# EasyEDA Pro project ProProject_Quantum Mega_v0.2_2024-08-26.epro, schematic Top
Create Date: 2024-05-17; Page Name: P1; Project Name: Quantum Mega; Schematic Name: Top; Update Date: 2024-08-18; Company: EasyEDA.com; Drawn: EasyEDA; Page Size: A4; Part Number: JLCPCB-002; Reviewed: EasyEDA; Version: V0.1
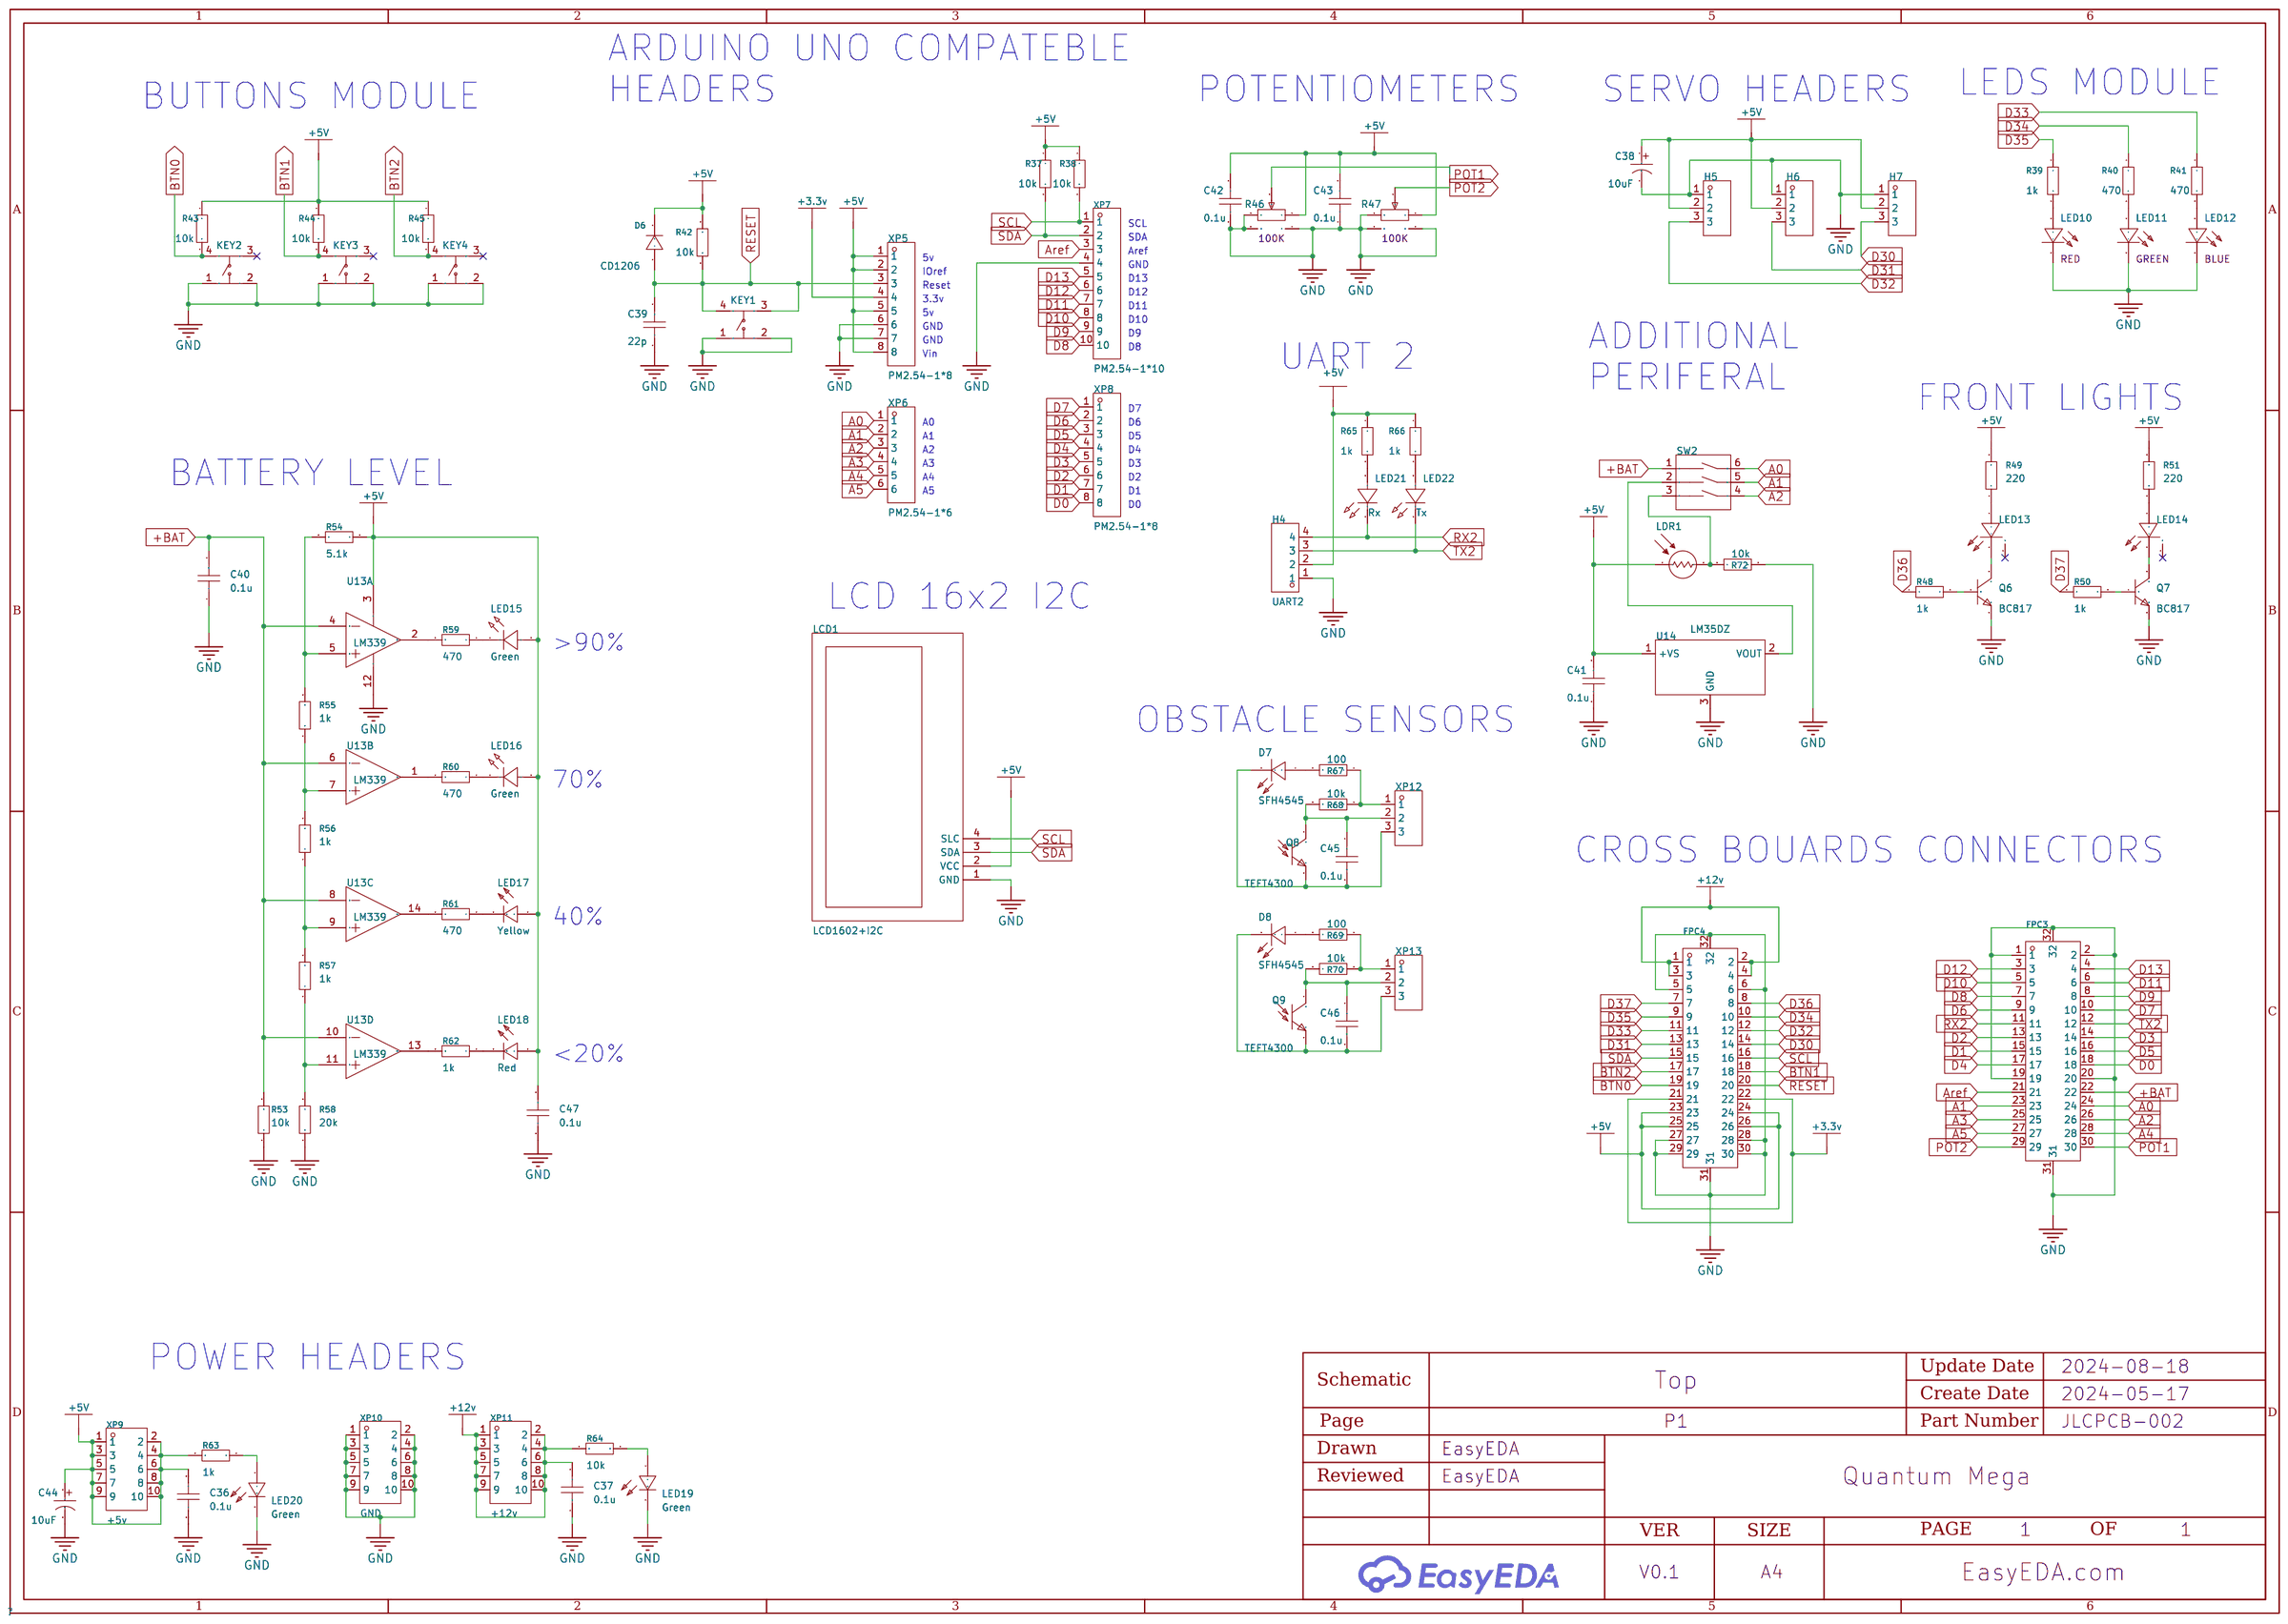
[diagram p1: schematic sheet]

## Parts
C36  0.1u  [C0805]
C37  0.1u  [C0805]
C38  10uF  [CAP-SMD_L3.5-W2.8-R-RD]
C39  22p  [C0805]
C40  0.1u  [C0805]
C41  0.1u  [C0805]
C42  0.1u  [C0805]
C43  0.1u  [C0805]
C44  10uF  [CAP-SMD_L3.5-W2.8-R-RD]
C45  0.1u  [C0805]
C46  0.1u  [C0805]
C47  0.1u  [C0805]
D6  CD1206  [D1206-RD]
D7  SFH4545  [LED-TH_BD5.0-P2.54-FD]
D8  SFH4545  [LED-TH_BD5.0-P2.54-FD]
FPC3  FFC05012-30SSA124W5M  [FPC-SMD_FFC05012-30SSA124W5M]
FPC4  FFC05012-30SSA124W5M  [FPC-SMD_FFC05012-30SSA124W5M]
H4  UART2  [HDR-TH_4P-P2.54-H-M-W10.3]
H5  D32  [HDR-TH_3P-P2.54-V-M]
H6  D31  [HDR-TH_3P-P2.54-V-M]
H7  D30  [HDR-TH_3P-P2.54-V-M]
KEY1  RESET  [KEY-TH_4P-L6.0-W6.0-P4.50-LS7.5]
KEY2  D41  [KEY-TH_4P-L6.0-W6.0-P4.50-LS7.5]
KEY3  D40  [KEY-TH_4P-L6.0-W6.0-P4.50-LS7.5]
KEY4  D39  [KEY-TH_4P-L6.0-W6.0-P4.50-LS7.5]
LCD1  LCD1602+I2C  [HDR-TH_4P-P2.54-V-F]
LDR1  -  [PHOTO_RESISTOR]
LED10  D35  [LED-TH_BD4.0-P2.54-FD_RED]
LED11  D34  [LED-TH_BD4.0-P2.54-FD_RED]
LED12  D33  [LED-TH_BD4.0-P2.54-FD_RED]
LED13  LED-1204-WHITE  [LED-SMD_3P-L3.20-W1.50-WHITE-SIDE-R-RD]
LED14  LED-1204-WHITE  [LED-SMD_3P-L3.20-W1.50-WHITE-SIDE-R-RD]
LED15  Green  [LED0805-RD_RED]
LED16  Green  [LED0805-RD_YELLOW]
LED17  Yellow  [LED0805-R-RD_GREEN]
LED18  Red  [LED0805-R-RD_GREEN]
LED19  12v  [LED0805-R-RD_GREEN]
LED20  5v  [LED0805-R-RD_GREEN]
LED21  Rx  [LED0805-RD_RED]
LED22  Tx  [LED0805-RD_RED]
Q6  BC817  [SOT-23(SOT-23-3)]
Q7  BC817  [SOT-23(SOT-23-3)]
Q8  TEFT4300  [SENSOR-TH_TEFT4300]
Q9  TEFT4300  [SENSOR-TH_TEFT4300]
R37  10k  [R0805]
R38  10k  [R0805]
R39  1k  [R0805]
R40  470  [R0805]
R41  470  [R0805]
R42  10k  [R0805]
R43  10k  [R0805]
R44  10k  [R0805]
R45  10k  [R0805]
R46  A6  [RES-TH_RK09K1130AAU]
R47  A7  [RES-TH_RK09K1130AAU]
R48  1k  [R0805]
R49  220  [R0805]
R50  1k  [R0805]
R51  220  [R0805]
R53  10k  [R0805]
R54  5.1k  [R0805]
R55  1k  [R0805]
R56  1k  [R0805]
R57  1k  [R0805]
R58  20k  [R0805]
R59  470  [R0805]
R60  470  [R0805]
R61  470  [R0805]
R62  1k  [R0805]
R63  1k  [R0805]
R64  10k  [R0805]
R65  1k  [R0805]
R66  1k  [R0805]
R67  100  [R0805]
R68  10k  [R0805]
R69  100  [R0805]
R70  10k  [R0805]
R72  10k  [R0805]
SW2  KF1001-03P-B0-GL-DFT-01B  [SW-TH_6P-L9.9-W9.0-P2.54-LS7.6_BLUE]
U13  LM339  [SOP-14_L8.7-W3.9-P1.27-LS6.0-BL]  (sections 1,2,3,4)
U14  A1  [TO-92-3_L4.9-W3.7-P1.27-L]
XP5  PM2.54-1*8  [HDR-TH_8P-P2.54-V-F]
XP6  PM2.54-1*6  [HDR-TH_6P-P2.54-V-F]
XP7  PM2.54-1*10  [HDR-TH_10P-P2.54-V-F]
XP8  PM2.54-1*8  [HDR-TH_8P-P2.54-V-F]
XP9  +5v  [HDR-TH_10P-P2.54-V-F-R2-C5-S2.54-4]
XP10  GND  [HDR-TH_10P-P2.54-V-F-R2-C5-S2.54-4]
XP11  +12v  [HDR-TH_10P-P2.54-V-F-R2-C5-S2.54-4]
XP12  D32  [HDR-TH_3P-P2.54-V-M]
XP13  D32  [HDR-TH_3P-P2.54-V-M]

## Library data of the parts
C36 C37 C39-C43 C45-C47 = CAP_0805: Supplier Footprint: 0805
C38 C44 = CA45-B-25V-10uF-M: Capacitance: Tolerance:±20% Tolerance:±20% Rated Voltage: Equivalent Series Resistance(ESR):6Ω@100kHz Operating Temperature:-55℃~+125℃ Operating Temperature:-55℃~+125℃; LCSC Part Name: 10uF ±20% 25V; Supplier Part: C140404; Manufacturer: CEC(振华新云); Supplier Footprint: CASE-B-3528; JLCPCB Part Class: Extended Part; Datasheet: https://atta.szlcsc.com/upload/public/pdf/source/20171113/C140404_15105612875661115757.pdf; Supplier: LCSC; Tolerance: ±20%; Equivalent Series Resistance(ESR): 6Ω@100kHz; Operating Temperature: -55℃~+125℃
D6 = CD1206-S01575: Diode Configuration: Forward Voltage (Vf@If):1V@50mA Reverse Voltage (Vr): Average Rectified Current (Io): Power Dissipation: Reverse Leakage Current:2.5uA@75V Reverse Recovery Time (trr): Operating Temperature:-55℃~+125℃@(Tj) Operating Temperature:-55℃~+; LCSC Part Name: 电压:75V 电流:150mA 停产; Supplier Part: C75465; Manufacturer: BOURNS; Supplier Footprint: 1206; JLCPCB Part Class: Extended Part; Datasheet: https://atta.szlcsc.com/upload/public/pdf/source/20180126/C75465_15169562546211309449.pdf; Supplier: LCSC; Forward Voltage (Vf@If): 1V@50mA; Reverse Leakage Current: 2.5uA@75V; Operating Temperature: -55℃~+125℃@(Tj)
D7 D8 = SFH4550: Supplier Part: C706747; Supplier: LCSC
FPC3 FPC4 = FFC05012-30SSA124W5M: Locking Feature:抽屉式 Contact Type:单侧触点/Vertical Number of Contacts:30P Pitch:0.5mm Mounting Type:Brick nogging FFC, FCB Thickness:0.3mm FFC, FCB Thickness:0.3mm Height Above Board:- Operating Temperature Range:-40℃~+85℃ Operating Temperature Range:-40℃~+85; LCSC Part Name: 间距:0.5mm P数:30P 抽屉式 单侧触点/垂直; Supplier Part: C2834153; Manufacturer: TXGA(特思嘉); Supplier Footprint: SMD,P=0.5mm(交错脚); JLCPCB Part Class: Extended Part; Datasheet: https://atta.szlcsc.com/upload/public/pdf/source/20210517/C2834153_A4D413E3C8B5AC462050F50D944F5EA0.pdf; Supplier: LCSC; Locking Feature: 抽屉式; Contact Type: 单侧触点/Vertical; Number of Contacts: 30P; Pitch: 0.5mm; Mounting Type: Brick nogging; FFC, FCB Thickness: 0.3mm; Operating Temperature Range: -40℃~+85℃
H4 = 0022285044: Supplier Part: C9900016049; Supplier Footprint: TH-4P; JLCPCB Part Class: Extended Part; Supplier: LCSC
H5-H7 XP12 XP13 = 5-146277-3: Pitch:2.54mm Circluar Pins/Square Pins:Square Pins Mounting Type:Straight Number of Rows:Plugin Number of Pins:3P Current Rating (Max):3A Voltage Rating (Max):- Length of Mating Pin:8.08mm Insulation Height:2.29mm Length of End Connection Pin:3.18mm Conta; LCSC Part Name: 间距:2.54mm 直插 方针; Supplier Part: C3327863; Manufacturer: TE Connectivity(泰科电子); Supplier Footprint: 插件,P=2.54mm; JLCPCB Part Class: Extended Part; Datasheet: https://atta.szlcsc.com/upload/public/pdf/source/20240320/B5A87472A4F0F2898233D24AD0789840.pdf; Supplier: LCSC; Pitch: 2.54mm; Circluar Pins/Square Pins: Square Pins; Mounting Type: Straight; Number of Rows: Plugin; Number of Pins: 3P; Current Rating (Max): 3A; Length of Mating Pin: 8.08mm; Insulation Height: 2.29mm; Length of End Connection Pin: 3.18mm; Contact Plating: Tin; Operating Temperature Range: -65℃~+105℃; Color: Black
KEY1-KEY4 = TL1105F160Q: Circuit:SPST Actuator Style:Round Button Operating Force:160gf Mounting Style:Straight Switch Length:6mm Switch Width:6mm Switch Height:0.7mm Contact Current:50mA Voltage Rating (DC):12V With Lamp:- Pin Style:PCPin Mechanical Life:- Operating Temperature:; LCSC Part Name: 6*6*0.7mm 直插 轻触开关; Supplier Part: C273473; Manufacturer: E-Switch; Supplier Footprint: 插件,6x6mm; JLCPCB Part Class: Extended Part; Datasheet: https://atta.szlcsc.com/upload/public/pdf/source/20180927/C273473_CCBD97E41A3934EE0DE01B218410C479.pdf; Supplier: LCSC; Circuit: SPST; Actuator Style: Round Button; Operating Force: 160gf; Mounting Style: Straight; Switch Length: 6mm; Switch Width: 6mm; Switch Height: 0.7mm; Contact Current: 50mA; Voltage Rating (DC): 12V; Pin Style: PCPin; Operating Temperature: -20℃~+70℃
LCD1 = LCD1602+I2C
LDR1 = Photo-Resistor
LED10 = LED: Supplier Part: C9900015665; Manufacturer Part: RED; Supplier Footprint: SIP-2P; Supplier: LCSC
LED11 = LED: Supplier Part: C9900015665; Manufacturer Part: GREEN; Supplier Footprint: SIP-2P; Supplier: LCSC
LED12 = LED: Supplier Part: C9900015665; Manufacturer Part: BLUE; Supplier Footprint: SIP-2P; Supplier: LCSC
LED13 LED14 = LED-1204-#: Supplier Part: C9900023088; Supplier Footprint: LED-1204-B; Supplier: LCSC
LED15 LED21 LED22 = 0805-0.8T红色: Supplier Part: C9900003058; Supplier Footprint: LED0805; Supplier: LCSC
LED16 = EH-C171KSKT: Supplier Part: C9900008534; Supplier Footprint: LED0805; Supplier: LCSC
LED17-LED20 = EH-C171TGKT-5A: Supplier Part: C9900008533; Supplier Footprint: LED0805; Supplier: LCSC
Q6 Q7 = BC817: link: https://item.szlcsc.com/9070.html; 3DModel: SOT-23-3P_L2.9-W1.3-H1.0-LS2.4-P0.95; Supplier: LCSC; Manufacturer: CJ; image: //image.lceda.cn/szlcsc/C8589.jpg; Supplier Part: C8589; JLCPCB Part Class: Extended Part
Q8 Q9 = TEFT4300: Transistor Type:NPN Collector Emitter Voltage:70V Collector Emitter Voltage:70V Collector Current (Ic):50mA Dissipation Power(Max):100mW Collector Dark Current:1nA Peak Wavelength:925nm Viewing Angle:±30° Operating Temperature:-40℃~+100℃ Operating Tempera; LCSC Part Name: 925nm的NPN光电三极管; Supplier Part: C118301; Manufacturer: VISHAY(威世); Supplier Footprint: 插件,D=3mm; JLCPCB Part Class: Extended Part; Datasheet: https://atta.szlcsc.com/upload/public/pdf/source/20170713/C118301_1499918878961816729.pdf; Supplier: LCSC; Transistor Type: NPN; Collector Emitter Voltage: 70V; Collector Current (Ic): 50mA; Dissipation Power(Max): 100mW; Collector Dark Current: 1nA; Peak Wavelength: 925nm; Viewing Angle: ±30°; Operating Temperature: -40℃~+100℃
R37-R45 R48-R51 R53-R70 R72 = 0805 resistor: LCSC Part Name: 12kΩ ±1% 125mW 厚膜电阻; Supplier Part: C17444; Manufacturer: UNI-ROYAL(厚声); Manufacturer Part: 0805W8F1202T5E; Supplier Footprint: 0805; JLCPCB Part Class: Basic Part; Datasheet: https://atta.szlcsc.com/upload/public/pdf/source/20200306/C422600_1E6D84923E4A46A82E41ADD87F860B5C.pdf; Supplier: LCSC; Tolerance: ±1%; Temperature Coefficient: ±100ppm/℃; Type: Thick Film Resistors; Operating Temperature Range: -55℃~+155℃
R46 R47 = POT-R09V-100K: Supplier Part: C9900018037; Manufacturer Part: 100K; Supplier Footprint: 插件; Supplier: LCSC
SW2 = KF1001-03P-B0-GL-DFT-01B: Supplier Part: C2897603; Manufacturer: 凯峰; Supplier Footprint: 插件; JLCPCB Part Class: Extended Part; Datasheet: https://atta.szlcsc.com/upload/public/pdf/source/20201229/C976324_7B1CB18A800AB7399198E0C73F3ACFC5.pdf; Supplier: LCSC
U13 = LM339: Supply Voltage:2V~36V Supply Voltage:2V~36V Output Type:- Output Mode:-; Supplier Part: C2829428; Manufacturer: CJ(江苏长电/长晶); Supplier Footprint: SOP-14; JLCPCB Part Class: Extended Part; Datasheet: https://atta.szlcsc.com/upload/public/pdf/source/20220509/7630064B173EFBB548D5372525D9DF90.pdf; Supplier: LCSC; Supply Voltage: 2V~36V
U14 = LM35DZ/NOPB_C12165: Resolution:±1.5℃ Resolution:±1.5℃ Supply Voltage:4V~30V Supply Voltage:4V~30V; LCSC Part Name: LM35DZ/NOPB; Supplier Part: C12165; Manufacturer: TI(德州仪器); Manufacturer Part: LM35DZ/NOPB; Supplier Footprint: TO-92; JLCPCB Part Class: Extended Part; Datasheet: https://www.ti.com/cn/lit/gpn/lm35; Supplier: LCSC; Resolution: ±1.5℃; Supply Voltage: 4V~30V
XP5 XP8 = PM2.54-1*8: Holes Structure:1x8P Pitch:2.54mm Row Spacing:2.54mm Circular Hole / Square Hole:方孔 Mounting Type:Straight Number of Rows:Plugin Number of Holes:8P Current Rating (Max):2.5A Holes Direction:Top Insulation Height:8.5mm Operating Temperature Range:-40℃~+105; LCSC Part Name: 间距:2.54mm 1x8P 直插; Supplier Part: C5224027; Manufacturer: ZHOURI(洲日); Supplier Footprint: 插件,P=2.54mm; JLCPCB Part Class: Extended Part; Datasheet: https://atta.szlcsc.com/upload/public/pdf/source/20221031/E5BAE727A502DC7C69CE947E807E2296.pdf; Supplier: LCSC; Holes Structure: 1x8P; Pitch: 2.54mm; Row Spacing: 2.54mm; Circular Hole / Square Hole: 方孔; Mounting Type: Straight; Number of Rows: Plugin; Number of Holes: 8P; Current Rating (Max): 2.5A; Holes Direction: Top; Insulation Height: 8.5mm; Operating Temperature Range: -40℃~+105℃
XP6 = PM2.54-1*6: Holes Structure:1x6P Pitch:2.54mm Row Spacing:2.54mm Circular Hole / Square Hole:方孔 Mounting Type:Straight Number of Rows:Plugin Number of Holes:6P Current Rating (Max):2.5A Holes Direction:Top Insulation Height:8.5mm Operating Temperature Range:-40℃~+105; LCSC Part Name: 间距:2.54mm 1x6P 直插; Supplier Part: C5224026; Manufacturer: ZHOURI(洲日); Supplier Footprint: 插件,P=2.54mm; JLCPCB Part Class: Extended Part; Datasheet: https://atta.szlcsc.com/upload/public/pdf/source/20221031/E093F9F6C4E58F4CC51055FE981DF342.pdf; Supplier: LCSC; Holes Structure: 1x6P; Pitch: 2.54mm; Row Spacing: 2.54mm; Circular Hole / Square Hole: 方孔; Mounting Type: Straight; Number of Rows: Plugin; Number of Holes: 6P; Current Rating (Max): 2.5A; Holes Direction: Top; Insulation Height: 8.5mm; Operating Temperature Range: -40℃~+105℃
XP7 = PM2.54-1*10: Holes Structure:1x10P Pitch:2.54mm Row Spacing:2.54mm Circular Hole / Square Hole:方孔 Mounting Type:Straight Number of Rows:Plugin Number of Holes:10P Current Rating (Max):2.5A Holes Direction:Top Insulation Height:8.5mm Operating Temperature Range:-40℃~+1; LCSC Part Name: 间距:2.54mm 1x10P 直插; Supplier Part: C5116489; Manufacturer: ZHOURI(洲日); Supplier Footprint: 插件,P=2.54mm; JLCPCB Part Class: Extended Part; Datasheet: https://atta.szlcsc.com/upload/public/pdf/source/20220803/0A90D5F6AD0A236C4C7DDEE7A7CA5EA3.pdf; Supplier: LCSC; Holes Structure: 1x10P; Pitch: 2.54mm; Row Spacing: 2.54mm; Circular Hole / Square Hole: 方孔; Mounting Type: Straight; Number of Rows: Plugin; Number of Holes: 10P; Current Rating (Max): 2.5A; Holes Direction: Top; Insulation Height: 8.5mm; Operating Temperature Range: -40℃~+105℃
XP9-XP11 = BX-PM2.54-2-5PY: Holes Structure:2x5P Pitch:2.54mm Row Spacing:2.54mm Circular Hole / Square Hole:方孔 Mounting Type:Straight Number of Rows:双排 Number of Holes:5P Current Rating (Max):3A Voltage Rating (Max):1kV Holes Direction:Top Insulation Height:8.5mm Contact Material:b; LCSC Part Name: 间距:2.54mm 2x5P 直插; Supplier Part: C18078144; Manufacturer: Bossie(博锡); Supplier Footprint: 插件,P=2.54mm; Datasheet: https://atta.szlcsc.com/upload/public/pdf/source/20231017/E0239238C230B317C720B00E1BA41105.pdf; Supplier: LCSC; Holes Structure: 2x5P; Pitch: 2.54mm; Row Spacing: 2.54mm; Circular Hole / Square Hole: 方孔; Mounting Type: Straight; Number of Rows: 双排; Number of Holes: 5P; Current Rating (Max): 3A; Voltage Rating (Max): 1kV; Holes Direction: Top; Insulation Height: 8.5mm; Contact Material: bronze; Contact Plating: Gold; Operating Temperature Range: -40℃~+105℃; Soldering Temperature(Max): 260℃@5S

## Nets
+3.3v: FPC4.21 FPC4.22 XP5.4
+5V: C36.2 C38.1 C41.2 C42.2 C43.2 C44.1 C47.2 D6.1(K) FPC4.23 FPC4.24 FPC4.25 FPC4.26 H4.2 H5.2 H6.2 H7.2 LCD1.2(VCC) LDR1.1 LED15.2(A) LED16.2(A) LED17.1(A) LED18.1(A) R37.1 R38.1 R42.1 R43.1 R44.1 R45.1 R46.1 R47.1 R49.2 R51.2 R54.1 R63.2 R65.1 R66.1 U13.3(VCC) U14.1(+VS) XP5.1 XP5.2 XP5.5 XP5.8 XP9.1 XP9.2 XP9.3 XP9.4 XP9.5 XP9.6 XP9.7 XP9.8 XP9.9 XP9.10
+12v: C37.2 FPC4.1 FPC4.2 FPC4.3 FPC4.4 R64.2 XP11.1 XP11.2 XP11.3 XP11.4 XP11.5 XP11.6 XP11.7 XP11.8 XP11.9 XP11.10
GND: C36.1 C37.1 C38.2 C39.2 C40.1 C41.1 C42.1 C43.1 C44.2 C47.1 FPC3.1 FPC3.2 FPC3.19 FPC3.20 FPC3.31 FPC3.32 FPC4.5 FPC4.6 FPC4.27 FPC4.28 FPC4.29 FPC4.30 FPC4.31 FPC4.32 H4.1 H5.1 H6.1 H7.1 KEY1.1 KEY1.2 KEY2.1 KEY2.2 KEY3.1 KEY3.2 KEY4.1 KEY4.2 LCD1.1(GND) LED10.2(-) LED11.2(-) LED12.2(-) LED19.2(C) LED20.2(C) Q6.2(E) Q7.2(E) R46.3 R46.4 R46.5 R47.3 R47.4 R47.5 R53.1 R58.1 R72.1 U13.12(GND) U14.3(GND) XP5.6 XP5.7 XP7.4 XP10.1 XP10.2 XP10.3 XP10.4 XP10.5 XP10.6 XP10.7 XP10.8 XP10.9 XP10.10
+BAT: C40.2 FPC3.22 R53.2 SW2.1 U13.4(IN1-) U13.6(IN2-) U13.8(IN3-) U13.10(IN4-)
A0: FPC3.24 SW2.6 XP6.1
A1: FPC3.23 SW2.5 XP6.2
A2: FPC3.26 SW2.4 XP6.3
A3: FPC3.25 XP6.4
A4: FPC3.28 XP6.5
A5: FPC3.27 XP6.6
Aref: FPC3.21 XP7.3
BTN0: FPC4.19 KEY2.4 R43.2
BTN1: FPC4.18 KEY3.4 R44.2
BTN2: FPC4.17 KEY4.4 R45.2
D0: FPC3.18 XP8.8
D1: FPC3.15 XP8.7
D2: FPC3.13 XP8.6
D3: FPC3.14 XP8.5
D4: FPC3.17 XP8.4
D5: FPC3.16 XP8.3
D6: FPC3.9 XP8.2
D7: FPC3.10 XP8.1
D8: FPC3.7 XP7.10
D9: FPC3.8 XP7.9
D10: FPC3.5 XP7.8
D11: FPC3.6 XP7.7
D12: FPC3.3 XP7.6
D13: FPC3.4 XP7.5
D30: FPC4.14 H7.3
D31: FPC4.13 H6.3
D32: FPC4.12 H5.3
D33: FPC4.11 R41.1
D34: FPC4.10 R40.1
D35: FPC4.9 R39.1
D36: FPC4.8 R48.1
D37: FPC4.7 R50.1
POT1: FPC3.30 R46.2
POT2: FPC3.29 R47.2
RESET: C39.1 D6.2(A) FPC4.20 KEY1.3 KEY1.4 R42.2 XP5.3
RX2: FPC3.11 H4.4 LED21.1(K)
SCL: FPC4.16 LCD1.4(SLC) R38.2 XP7.1
SDA: FPC4.15 LCD1.3(SDA) R37.2 XP7.2
TX2: FPC3.12 H4.3 LED22.1(K)
$1N2925: LED10.1(+) R39.2
$1N2926: LED11.1(+) R40.2
$1N2927: LED12.1(+) R41.2
$1N3000: LED13.2(-) Q6.3(C)
$1N3001: LED13.1(+) R49.1
$1N3003: Q6.1(B) R48.2
$1N3005: LED14.2(-) Q7.3(C)
$1N3007: Q7.1(B) R50.2
$1N3009: LED14.1(+) R51.1
$1N8006: R55.1 R56.2 U13.7(IN2+)
$1N8015: R56.1 R57.2 U13.9(IN3+)
$1N8024: R57.1 R58.2 U13.11(IN4+)
$1N8311: R59.2 U13.2(OUT1)
$1N8350: R60.2 U13.1(OUT2)
$1N8389: R61.2 U13.14(OUT3)
$1N8428: R62.2 U13.13(OUT4)
$1N8588: LED15.1(K) R59.1
$1N8590: LED16.1(K) R60.1
$1N8592: LED17.2(C) R61.1
$1N8594: LED18.2(C) R62.1
$1N8734: R54.2 R55.2 U13.5(IN1+)
$1N8989: LED19.1(A) R64.1
$1N9069: LED20.1(A) R63.1
$1N18209: LED21.2(A) R65.2
$1N18241: LED22.2(A) R66.2
$1N20700: R67.1 R68.1 XP12.1
$1N20704: D7.1(A) R67.2
$1N20961: R69.1 R70.1 XP13.1
$1N20964: D8.1(A) R69.2
$1N28690: SW2.2 U14.2(VOUT)
$1N28836: LDR1.2 R72.2 SW2.3
$1N31594: C46.1 Q9.1(C) R70.2 XP13.2
$1N31601: C46.2 D8.2(K) Q9.2(E) XP13.3
$1N31638: C45.1 Q8.1(C) R68.2 XP12.2
$1N31645: C45.2 D7.2(K) Q8.2(E) XP12.3

Not connected (* = marked no-connect by the designer): KEY2 3*; KEY3 3*; KEY4 3*; LED13 3*; LED14 3*

## Notes on the sheet
- BUTTONS MODULE
- ARDUINO UNO COMPATEBLE
  HEADERS
- POTENTIOMETERS
- SERVO HEADERS
- LEDS MODULE
- SCL
- SDA
- Aref
- 5v
- GND
- IOref
- Reset
- D13
- 3.3v
- D12
- 5v
- D10
- D11
- GND
- D9
- GND
- D8
- Vin
- UART 2
- ADDITIONAL
  PERIFERAL
- D7
- FRONT LIGHTS
- A0
- D6
- A1
- D5
- A2
- A3
- D3
- D4
- A4
- D2
- BATTERY LEVEL
- A5
- D1
- D0
- LCD 16x2 I2C
- >90%
- OBSTACLE SENSORS
- 70%
- CROSS BOUARDS CONNECTORS
- 40%
- <20%
- POWER HEADERS
